# EAGLE design roomac33 (EAGLE 8.6.3)
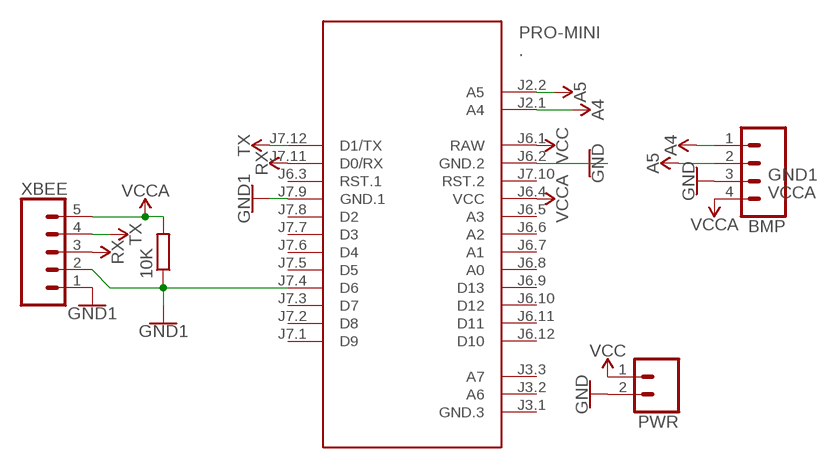
[diagram p0: schematic, sheet 1]

## Parts
10K  R0204/7  [0204/7]
BMP  CONN_04  [1X04]
PRO-MINI  .  ARDUINO-PRO-MINI-3.3V#NP  [ARDUINO-PRO-MINI#NP]
PWR  CONN_025MM  [SCREWTERMINAL-5MM-2]
XBEE  CONN_05  [1X05]

## Nets
A4: BMP.1 PRO-MINI.J2.1(A4)
A5: BMP.2 PRO-MINI.J2.2(A5)
GND: 10K.1 PRO-MINI.J7.4(D6) PRO-MINI.J7.9(GND.1) XBEE.1 XBEE.2 ; supply symbol labelled GND1
GND1: BMP.3 PRO-MINI.J6.2(GND.2) PWR.2 ; supply symbol labelled GND
RX: PRO-MINI.J7.11(D0/RX) XBEE.3
TX: PRO-MINI.J7.12(D1/TX) XBEE.4
VCC: PRO-MINI.J6.1(RAW) PWR.1
VCCA: 10K.2 BMP.4 PRO-MINI.J6.4(VCC) XBEE.5
Unconnected: PRO-MINI.J3.1(GND.3) PRO-MINI.J3.2(A6) PRO-MINI.J3.3(A7) PRO-MINI.J6.3(RST.1) PRO-MINI.J6.5(A3) PRO-MINI.J6.6(A2) PRO-MINI.J6.7(A1) PRO-MINI.J6.8(A0) PRO-MINI.J6.9(D13) PRO-MINI.J6.10(D12) PRO-MINI.J6.11(D11) PRO-MINI.J6.12(D10) PRO-MINI.J7.1(D9) PRO-MINI.J7.2(D8) PRO-MINI.J7.3(D7) PRO-MINI.J7.5(D5) PRO-MINI.J7.6(D4) PRO-MINI.J7.7(D3) PRO-MINI.J7.8(D2) PRO-MINI.J7.10(RST.2)

## Library data of the parts
10K = eagle-ltspice:R: RESISTOR, European symbol; SPICEMODEL: NONE; SPICEPREFIX: R
BMP = SparkFun-Connectors:CONN_04: Multi connection point. Often used as Generic Header-pin footprint for 0.1 inch spaced/style header connections On any of the 0.1 inch spaced packages, you can populate with these: Break Away Headers - Straight <https://www.sparkfun.com/products/116> (PRT-00116) Break Away Male Headers - Right Angle <https://www.sparkfun.com/products/553> (PRT-00553) Female Headers <https://www.sparkfun.com/products/115> (PRT-00115) Break Away Headers - Machine Pin <https://www.sparkfun.com/products/117> (PRT-00117) Break Away Female Headers - Swiss Machine Pin <https://www.sparkfun.com/products/743> (PRT-00743) For SCREWTERMINALS and SPRING TERMINALS visit here: Screw Terimnals on SparkFun.com <https://www.sparkfun.com/search/results?term=Screw+Terminals> (5mm/3.5mm/2.54mm spacing) This device is also useful as a general connection point to wire up your design to another part of your project. Our various solder wires solder well into these plated through hole pads. Hook-Up Wire - Assortment (Stranded, 22 AWG) <https://www.sparkfun.com/products/11375> (PRT-11375) Hook-Up Wire - Assortment (Solid Core, 22 AWG) <https://www.sparkfun.com/products/11367> (PRT-11367) View the entire wire category on our website here <https://www.sparkfun.com/categories/141> Special notes: Molex polarized connector foot print use with SKU : PRT-08231 with associated crimp pins and housings. 1MM SMD Version SKU: PRT-10208; PROD_ID: CONN-09696
PRO-MINI = diy-modules:ARDUINO-PRO-MINI-*#NP: Arduino Pro Mini (and compatible devices) without programming pads More details available here: https://www.arduino.cc/en/Main/ArduinoBoardProMini Click here to find device on ebay.com <http://www.ebay.com/sch/arduino+pro+mini>
PWR = SparkFun-Connectors:CONN_02: Multi connection point. Often used as Generic Header-pin footprint for 0.1 inch spaced/style header connections On any of the 0.1 inch spaced packages, you can populate with these: Break Away Headers - Straight <https://www.sparkfun.com/products/116> (PRT-00116) Break Away Male Headers - Right Angle <https://www.sparkfun.com/products/553> (PRT-00553) Female Headers <https://www.sparkfun.com/products/115> (PRT-00115) Break Away Headers - Machine Pin <https://www.sparkfun.com/products/117> (PRT-00117) Break Away Female Headers - Swiss Machine Pin <https://www.sparkfun.com/products/743> (PRT-00743) For SCREWTERMINALS and SPRING TERMINALS visit here: Screw Terimnals on SparkFun.com <https://www.sparkfun.com/search/results?term=Screw+Terminals> (5mm/3.5mm/2.54mm spacing) This device is also useful as a general connection point to wire up your design to another part of your project. Our various solder wires solder well into these plated through hole pads. Hook-Up Wire - Assortment (Stranded, 22 AWG) <https://www.sparkfun.com/products/11375> (PRT-11375) Hook-Up Wire - Assortment (Solid Core, 22 AWG) <https://www.sparkfun.com/products/11367> (PRT-11367) View the entire wire category on our website here <https://www.sparkfun.com/categories/141> Special notes: Molex polarized connector foot print use with: PRT-08233 with associated crimp pins and housings. 2.54_SCREWTERM for use with PRT-10571. 3.5mm Screw Terminal footprints for PRT-08084 5mm Screw Terminal footprints for use with PRT-08432; SF_SKU: PRT-08432
XBEE = SparkFun-Connectors:CONN_05: Multi connection point. Often used as Generic Header-pin footprint for 0.1 inch spaced/style header connections On any of the 0.1 inch spaced packages, you can populate with these: Break Away Headers - Straight <https://www.sparkfun.com/products/116> (PRT-00116) Break Away Male Headers - Right Angle <https://www.sparkfun.com/products/553> (PRT-00553) Female Headers <https://www.sparkfun.com/products/115> (PRT-00115) Break Away Headers - Machine Pin <https://www.sparkfun.com/products/117> (PRT-00117) Break Away Female Headers - Swiss Machine Pin <https://www.sparkfun.com/products/743> (PRT-00743) For SCREWTERMINALS and SPRING TERMINALS visit here: Screw Terimnals on SparkFun.com <https://www.sparkfun.com/search/results?term=Screw+Terminals> (5mm/3.5mm/2.54mm spacing) This device is also useful as a general connection point to wire up your design to another part of your project. Our various solder wires solder well into these plated through hole pads. Hook-Up Wire - Assortment (Stranded, 22 AWG) <https://www.sparkfun.com/products/11375> (PRT-11375) Hook-Up Wire - Assortment (Solid Core, 22 AWG) <https://www.sparkfun.com/products/11367> (PRT-11367) View the entire wire category on our website here <https://www.sparkfun.com/categories/141> Special notes: Molex polarized connector foot print use with SKU : PRT-08231 with associated crimp pins and housings. 1MM SMD Version SKU: PRT-10208

## Board
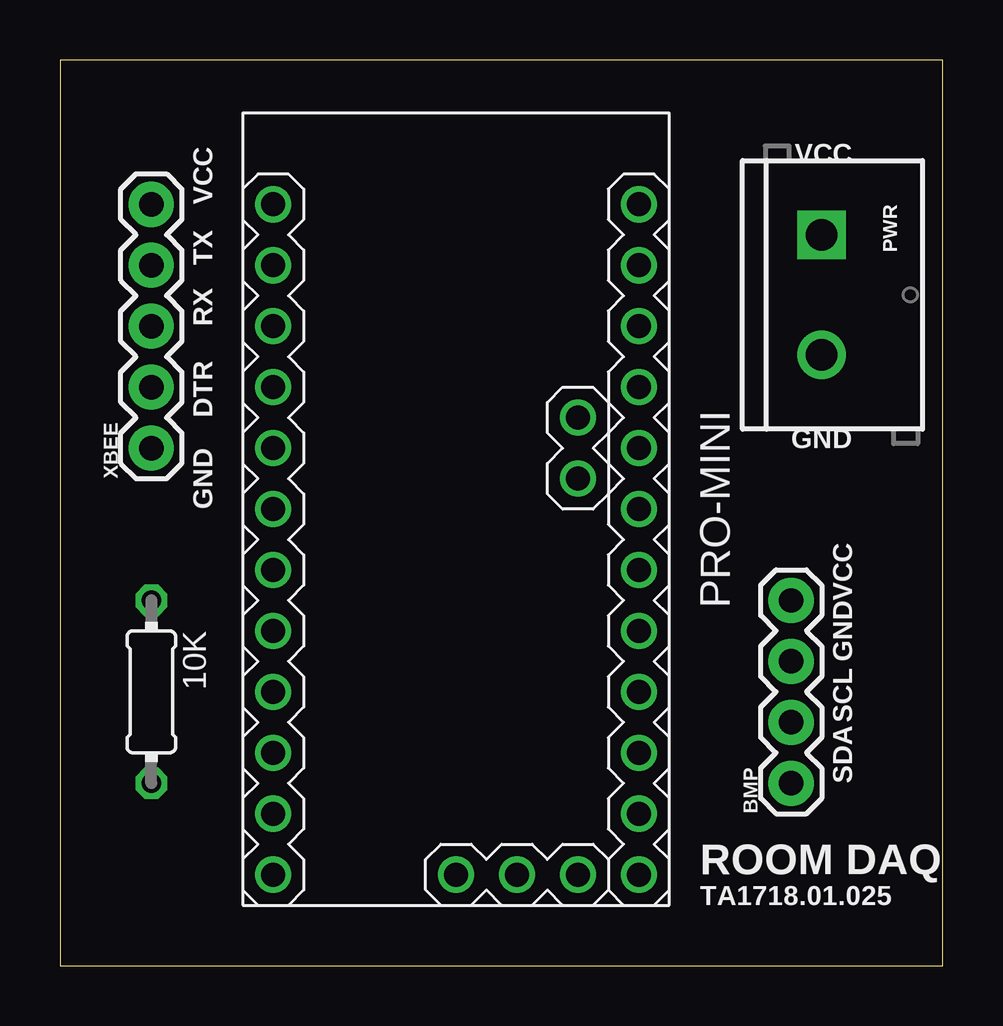
[diagram p1: board, top side]
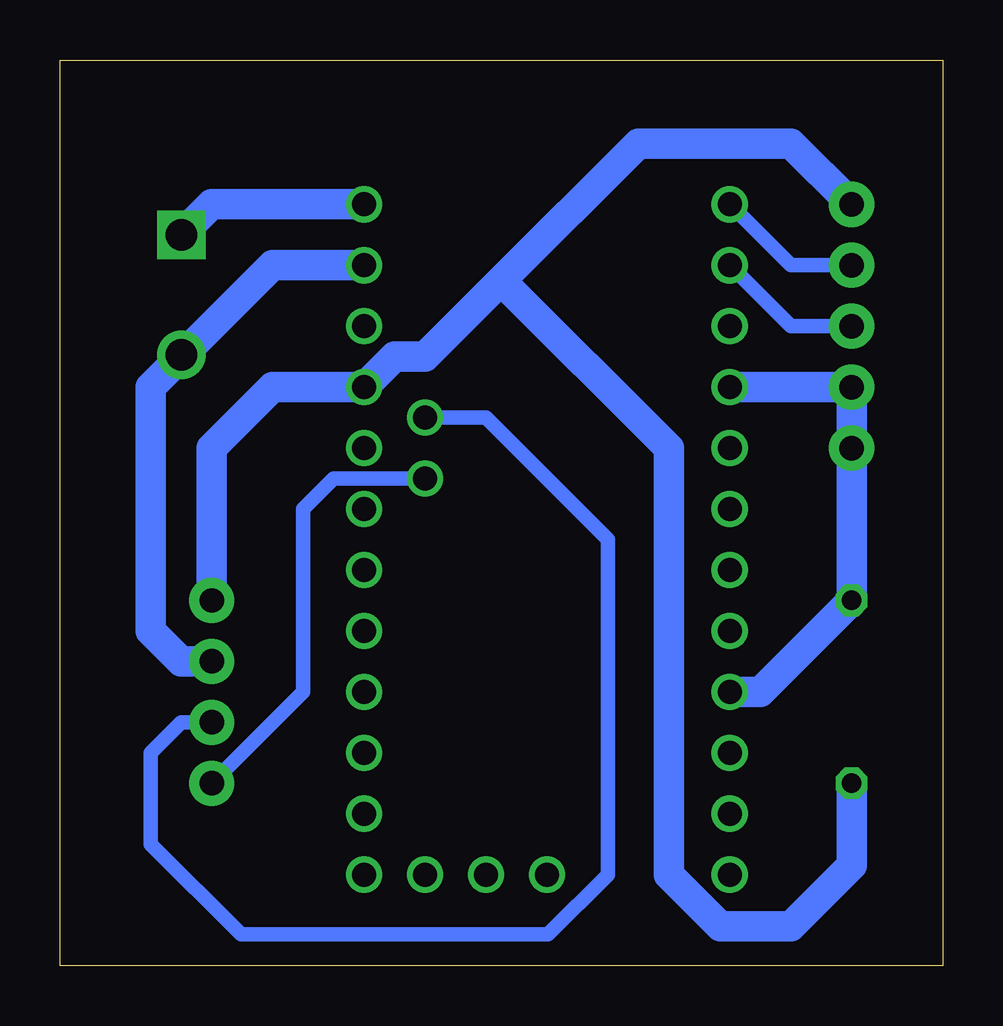
[diagram p2: board, bottom side, seen from below]

Size 36.81 x 37.77 mm. Coordinates in mm from the lower left corner, seen from the top.
Outline: 0,0 36.81,0 36.81,37.77 0,37.77 0,0
Copper layers (1*16): Top 0.035mm / dielectric 1.5mm / Bottom 0.035mm
Design rules "default": minimum track width 6mil, minimum drill 0.35mm, track to track 6mil, track to pad 6mil, pad to pad 6mil, via to via 6mil, smd to smd 6mil, copper to edge 40mil, drill to drill 6mil, minimum pad ring 10mil, minimum via ring 8mil, stop-mask expansion 4mil, vias tented up to drill 0mil, thermal gap 10mil

### Footprints (pad centres in the part's own frame; a part is rotated, then mirrored left to right if it is on the bottom)
0204/7 = drill 0.813 octagon: 1 -3.81,0; 2 3.81,0
1X04 = drill 1.016 pad 1.88: 1 0,0; 2 2.54,0; 3 5.08,0; 4 7.62,0
ARDUINO-PRO-MINI#NP = drill 1: J2.1 -1.27,5.08; J2.2 -3.81,5.08; J3.1 15.24,0; J3.2 15.24,2.54; J3.3 15.24,5.08; J6.1 -12.7,7.62; J6.2 -10.16,7.62; J6.3 -7.62,7.62; J6.4 -5.08,7.62; J6.5 -2.54,7.62; J6.6 0,7.62; J6.7 2.54,7.62; J6.8 5.08,7.62; J6.9 7.62,7.62; J6.10 10.16,7.62; J6.11 12.7,7.62; J6.12 15.24,7.62; J7.1 15.24,-7.62; J7.2 12.7,-7.62; J7.3 10.16,-7.62; J7.4 7.62,-7.62; J7.5 5.08,-7.62; J7.6 2.54,-7.62; J7.7 0,-7.62; J7.8 -2.54,-7.62; J7.9 -5.08,-7.62; J7.10 -7.62,-7.62; J7.11 -10.16,-7.62; J7.12 -12.7,-7.62
SCREWTERMINAL-5MM-2 = drill 1.3 pad 2.032 square: 1 0,0 | drill 1.3 pad 2.032: 2 5,0
1X05 = drill 1.016 pad 1.88: 1 0,0; 2 2.54,0; 3 5.08,0; 4 7.62,0; 5 10.16,0

### Placement (x,y rotation side)
10K  3.81,11.43 270 top
BMP  30.48,7.62 90 top
PRO-MINI  16.51,19.05 270 top
PWR  31.75,30.48 270 top
XBEE  3.81,21.59 90 top

### Tracks (layer width: path | path; a pad name or v marks a point on that pad's centre or on a via)
A4
  Bottom 0.61: BMP.1 26.67,11.43 26.67,19.05 25.4,20.32 PRO-MINI.J2.1
A5
  Bottom 0.61: BMP.2 31.75,10.16 33.02,8.89 33.02,5.08 29.26,1.32 16.46,1.32 13.97,3.81 13.97,17.78 19.05,22.86 PRO-MINI.J2.2
GND
  Bottom 1.27: PRO-MINI.J7.9 XBEE.2 XBEE.1 10K.1 7.62,11.43 PRO-MINI.J7.4
GND1
  Bottom 1.27: BMP.3 31.75,12.7 33.02,13.97 33.02,24.13 31.75,25.4 PWR.2 31.67,25.48 27.94,29.21 PRO-MINI.J6.2
RX
  Bottom 0.61: XBEE.3 6.35,26.67 PRO-MINI.J7.11
TX
  Bottom 0.61: XBEE.4 6.35,29.21 PRO-MINI.J7.12
VCC
  Bottom 1.27: PWR.1 30.48,31.75 PRO-MINI.J6.1
VCCA
  Bottom 1.27: BMP.4 30.48,21.59 27.94,24.13 PRO-MINI.J6.4 22.86,25.4 21.59,25.4 18.42,28.58 | XBEE.5 6.35,34.29 12.7,34.29 18.42,28.58 | 10K.2 3.81,4.19 6.35,1.65 9.27,1.65 11.43,3.81 11.43,21.59 18.42,28.58

### Text on the board
tNames: VCC | VCC | TX | RX | DTR | GND | GND | VCC | GND | SCL | SDA | ROOM DAQ | TA1718.01.025